# Altium schematic sheet POW.SchDoc
size A4
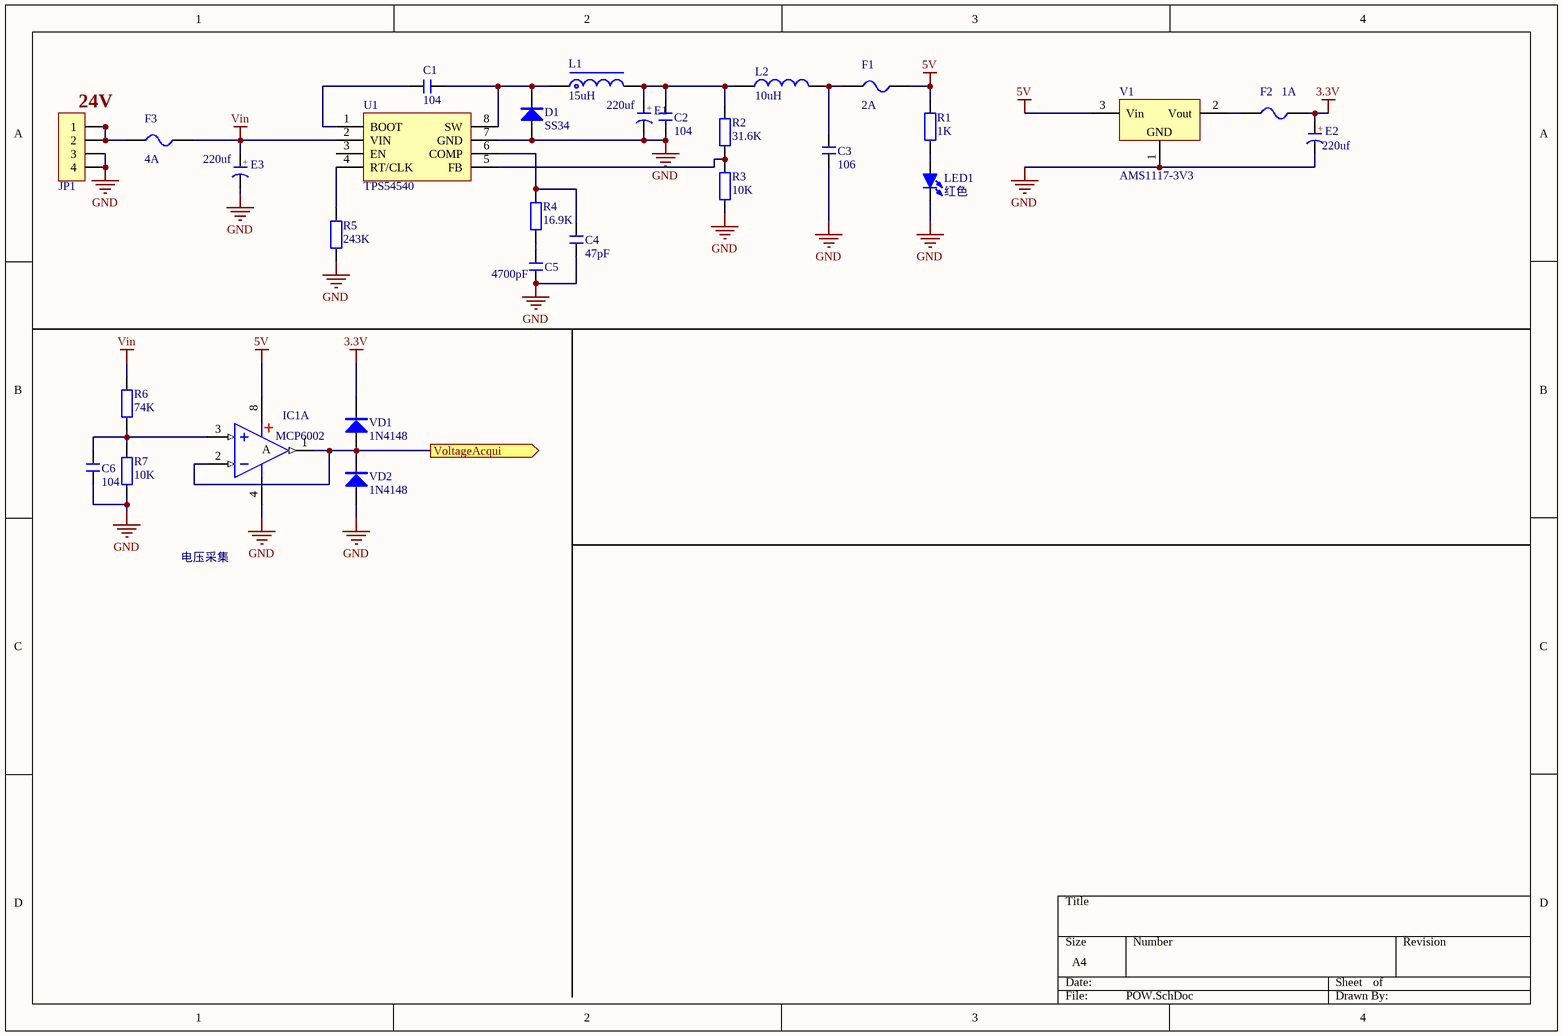
[diagram p0: POW.SchDoc]

## Parts
C1  104  [C 0603_L]
C2  104  [C 0603_L]
C3  106  [C 0603_L]
C4  47pF  [C 0603_L]
C5  4700pF  [C 0603_L]
C6  104  [C 0603_m]
D1  SS34  [SMC]
E1  220uf  [CM E(8*10.2)]
E2  220uf  [CM E(8*10.2)]
E3  220uf  [CM E(8*10.2)]
F1  2A  [FU 1206]
F2  1A  [FU 0805]
F3  4A  [FU 1206]
IC1  MCP6002  [SOP8_N]  (part A of 2)
JP1  HDR-1X4  [XH2.54-LI-4P]  (value not drawn)
L1  15uH  [CDRH73]
L2  10uH  [L 0805]
LED1  红色  [LED 0603G]
R1  1K  [R 0603_L]
R2  31.6K  [R 0603_L]
R3  10K  [R 0603_L]
R4  16.9K  [R 0603_L]
R5  243K  [R 0603_L]
R6  74K  [R 0603_L]
R7  10K  [R 0603_L]
U1  TPS54540  [SOP8_1]
V1  AMS1117-3V3  [SOT223_M]
VD1  1N4148  [SOD-323]
VD2  1N4148  [SOD-323]

## Ports
VoltageAcqui (out)

## Nets
3.3V: E2.1(A) F2.2 VD1.2(K)
5V: F1.2 IC1.8(V+) R1.2 V1.3(Vin)
GND: C2.1 C3.1 C4.1 C5.1 C6.1 D1.1(A) E1.2(K) E2.2(K) E3.2(K) IC1.4(V-) JP1.3 JP1.4 LED1.2(K) R3.1 R5.1 R7.1 U1.7(GND) V1.1(GND) VD2.1(A)
Vin: E3.1(A) F3.2 R6.2 U1.2(VIN)
VoltageAcqui: IC1.1(OUT) IC1.2(IN-) VD1.1(A) VD2.2(K) ; port VoltageAcqui
NetC1_1: C1.1 U1.1(BOOT)
NetC1_2: C1.2 D1.2(K) L1.1 U1.8(SW)
NetC2_2: C2.2 E1.1(A) L1.2 L2.1 R2.2
NetC3_2: C3.2 F1.1 L2.2
NetC4_2: C4.2 R4.2 U1.6(COMP)
NetC5_2: C5.2 R4.1
NetC6_2: C6.2 IC1.3(IN+) R6.1 R7.2
NetF2_1: F2.1 V1.2(Vout)
NetF3_1: F3.1 JP1.1 JP1.2
NetLED1_1: LED1.1(A) R1.1
NetR2_1: R2.1 R3.2 U1.5(FB)
NetR5_2: R5.2 U1.4(RT/CLK)

Not connected (* = marked no-connect by the designer): U1 3(EN)

## Notes on the sheet
- (near JP1) 24V
- 电压采集
- (in symbol C-CM) +
- (in symbol LM358, part A) A

## Library data of the parts
C1-C6 = C: 无极性贴片电容; 版权归属: 源创客; BOM名称: 无极性贴片电容; 学习资源: www.ooocke.com
D1 = SS34: 肖特基二极管; 版权归属: 源创客; 属性: 40V/3A; BOM名称: 肖特基二极管; 学习资源: www.ooocke.com
E1-E3 = C-CM: 贴片电解电容; 版权归属: 源创客; BOM名称: 贴片电解电容; 学习资源: www.ooocke.com
F1-F3 = FU: 贴片保险丝; 版权归属: 源创客; BOM名称: 贴片保险丝; 学习资源: www.ooocke.com
IC1 = LM358: 双路运放; 版权归属: 源创客; BOM名称: 双路运放; 学习资源: www.ooocke.com
JP1 = Header 4: 4P接插件; 版权归属: 源创客; BOM名称: 4P接插件; 学习资源: www.ooocke.com
L1 = L-CDRH: 功率屏蔽电感; 版权归属: 源创客; BOM名称: 功率屏蔽电感; 学习资源: www.ooocke.com
L2 = L: 小功率贴片电感; 版权归属: 源创客; BOM名称: 小功率贴片电感; 学习资源: www.ooocke.com
LED1 = LED-SMD: 贴片LED; 版权归属: 源创客; BOM名称: 贴片LED; 学习资源: www.ooocke.com
R1-R7 = R: 贴片电阻; 版权归属: 源创客; BOM名称: 贴片电阻; 学习资源: www.ooocke.com
V1 = AMS1117: 三端稳压芯片; BOM名称: 稳压芯片; 版权归属: 源创客; 学习资源: www.ooocke.com
VD1 VD2 = 1N4148: 高速开关二极管; 版权归属: 源创客; BOM名称: 高速开关二极管; 学习资源: www.ooocke.com